# EAGLE design adxrs300_breakout (EAGLE 6.1)
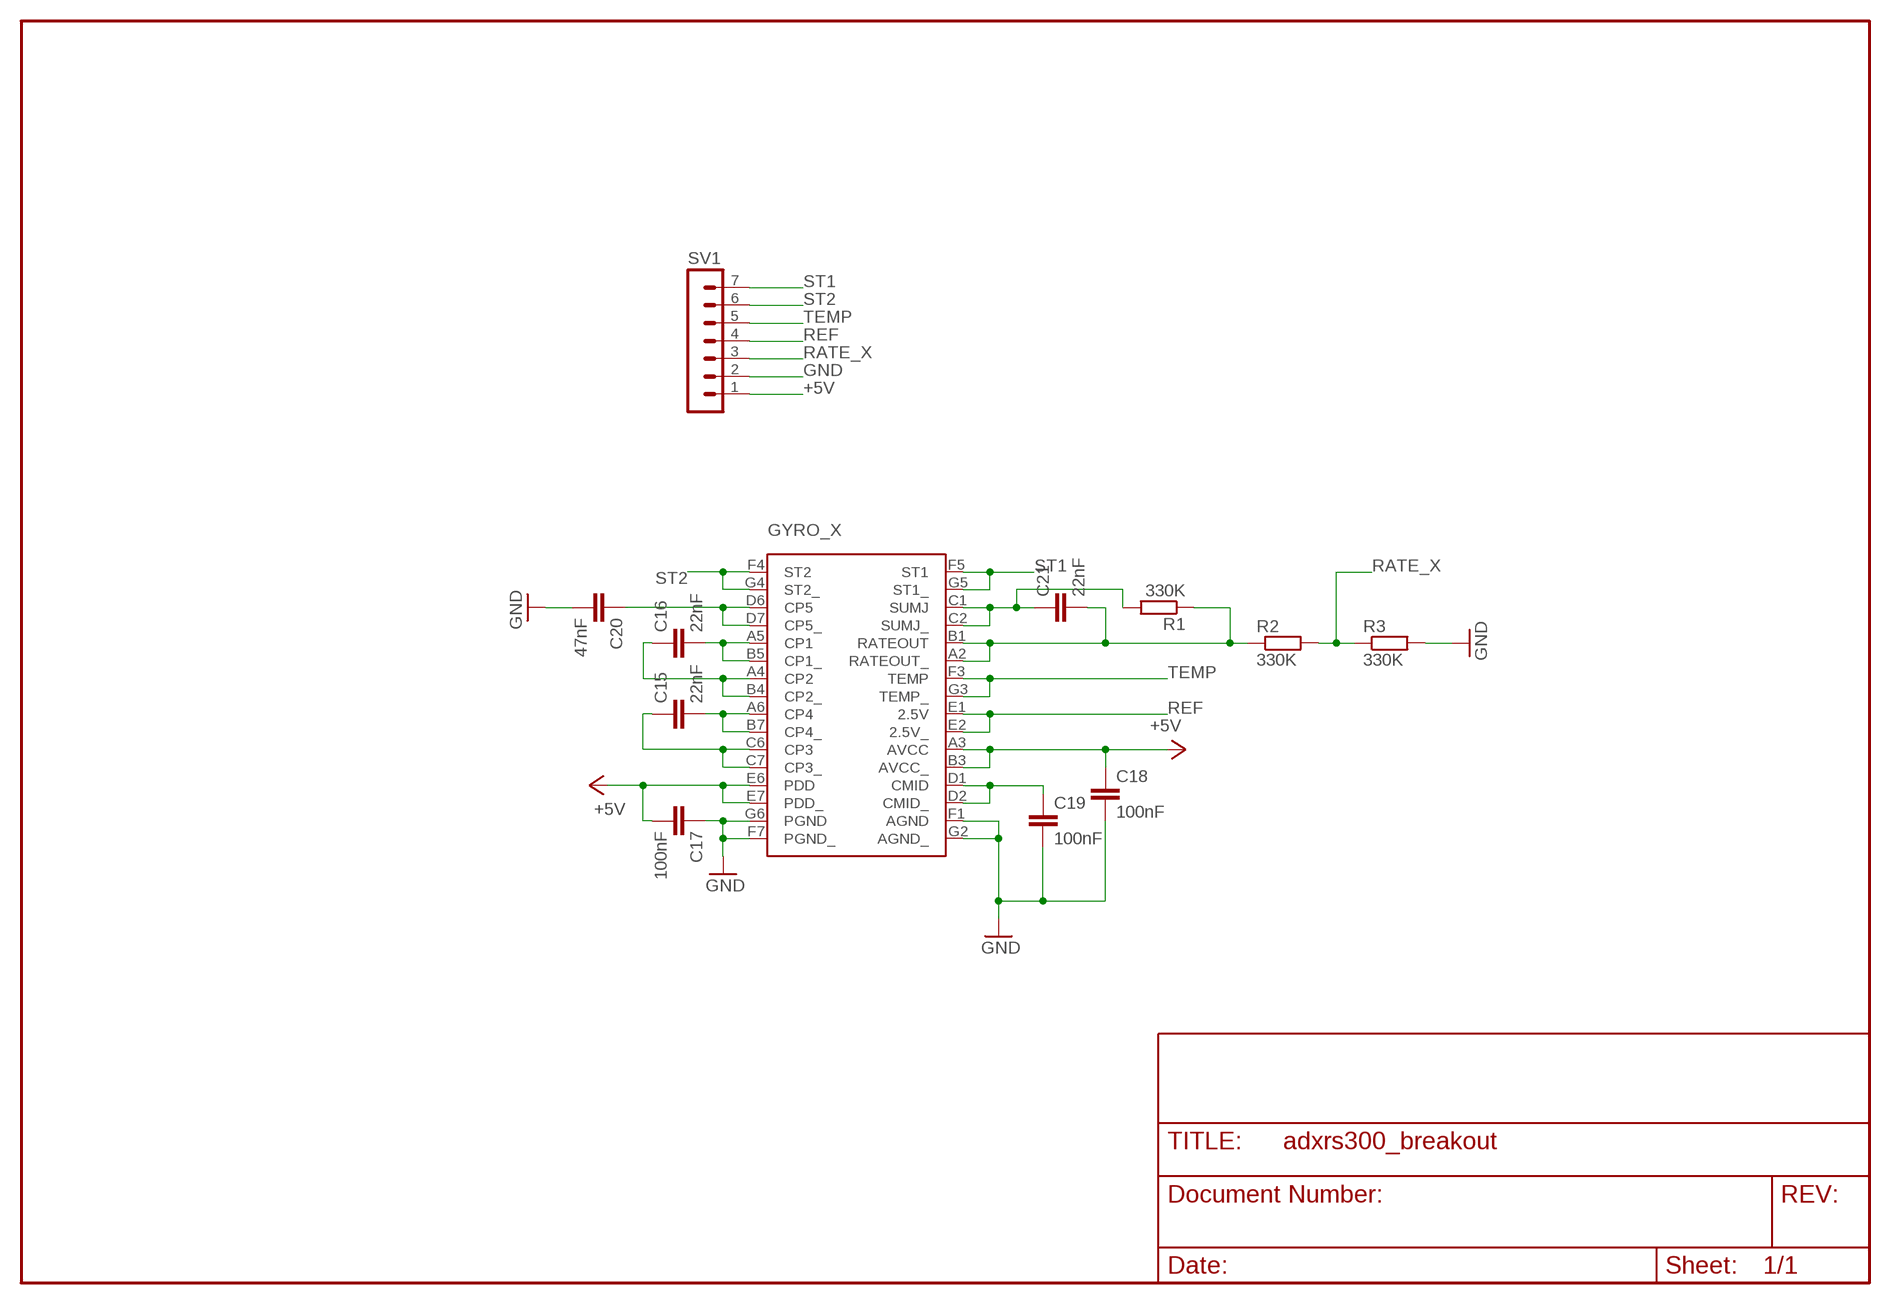
[diagram p0: schematic, sheet 1]

## Parts
C15  22nF  C-EUC0603K  [C0603K]
C16  22nF  C-EUC0603K  [C0603K]
C17  100nF  C-EUC0603K  [C0603K]
C18  100nF  C-EUC0603K  [C0603K]
C19  100nF  C-EUC0603K  [C0603K]
C20  47nF  C-EUC0603K  [C0603K]
C21  22nF  C-EUC0603K  [C0603K]
GYRO_X  ADXR  [BC-32]
R1  330K  R-EU_R0603  [R0603]
R2  330K  R-EU_R0603  [R0603]
R3  330K  R-EU_R0603  [R0603]
SV1  MA07-1  [MA07-1]

## Nets
+5V [power]: C17.2 C18.1 GYRO_X.A3(AVCC) GYRO_X.B3(AVCC_) GYRO_X.E6(PDD) GYRO_X.E7(PDD_) SV1.1
GND [power]: C17.1 C18.2 C19.2 C20.2 GYRO_X.F1(AGND) GYRO_X.F7(PGND_) GYRO_X.G2(AGND_) GYRO_X.G6(PGND) R3.2 SV1.2
N$6: C21.1 GYRO_X.C1(SUMJ) GYRO_X.C2(SUMJ_) R1.2
N$7: C15.1 GYRO_X.C6(CP3) GYRO_X.C7(CP3_)
N$11: C20.1 GYRO_X.D6(CP5) GYRO_X.D7(CP5_)
N$12: C16.2 GYRO_X.A5(CP1) GYRO_X.B5(CP1_)
N$13: C16.1 GYRO_X.A4(CP2) GYRO_X.B4(CP2_)
N$14: C15.2 GYRO_X.A6(CP4) GYRO_X.B7(CP4_)
N$19: C19.1 GYRO_X.D1(CMID) GYRO_X.D2(CMID_)
RATE_5V: C21.2 GYRO_X.A2(RATEOUT_) GYRO_X.B1(RATEOUT) R1.1 R2.1
RATE_X: R2.2 R3.1 SV1.3
REF: GYRO_X.E1(2.5V) GYRO_X.E2(2.5V_) SV1.4
ST1: GYRO_X.F5(ST1) GYRO_X.G5(ST1_) SV1.7
ST2: GYRO_X.F4(ST2) GYRO_X.G4(ST2_) SV1.6
TEMP: GYRO_X.F3(TEMP) GYRO_X.G3(TEMP_) SV1.5

## Library data of the parts
C15-C21 = rcl:C-EU: CAPACITOR, European symbol
GYRO_X = paparazzi:ADXR
R1-R3 = rcl:R-EU_: RESISTOR, European symbol
SV1 = con-lstb:MA07-1: PIN HEADER

## Net classes
0 default: width 0.305 mm, drill 0.305 mm, clearance 0.305 mm
1 power: width 0.305 mm, drill 0.305 mm, clearance 0.305 mm

## Board
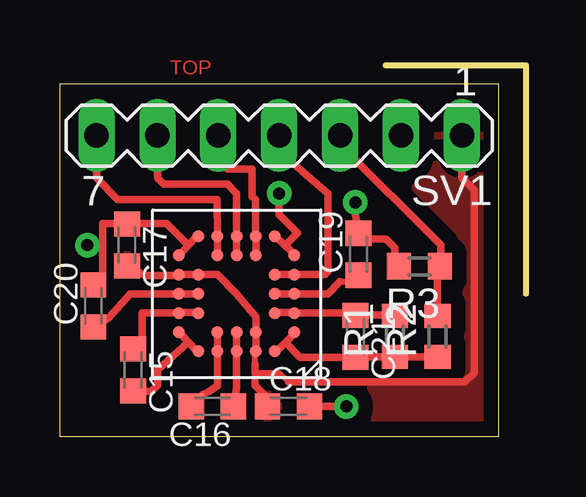
[diagram p1: board, top side]
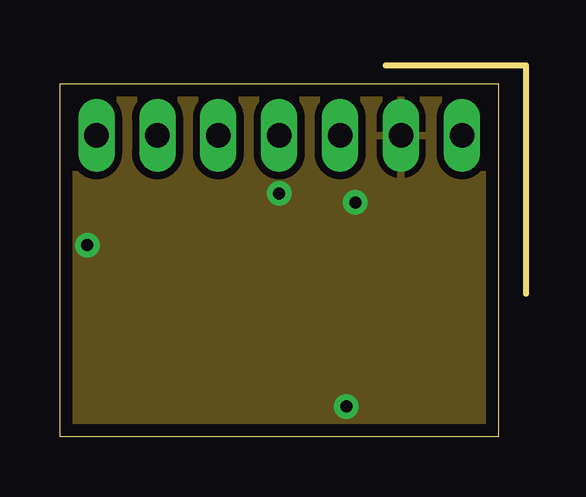
[diagram p2: board, inner layer Route2]
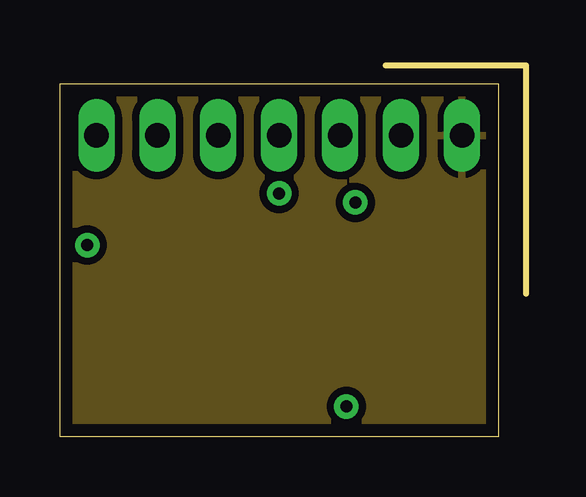
[diagram p3: board, inner layer Route15]
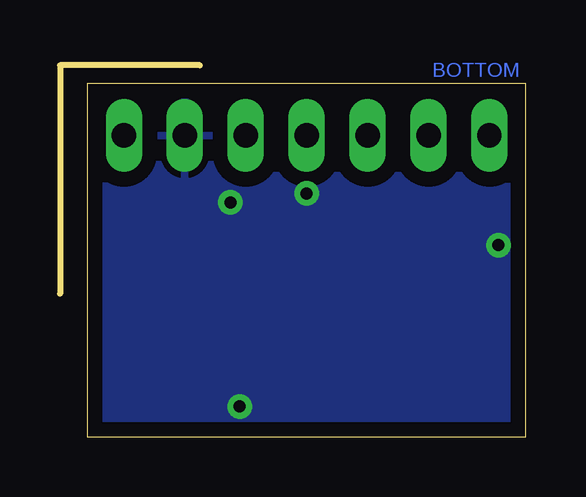
[diagram p4: board, bottom side, seen from below]

Size 19.43 x 15.49 mm. Coordinates in mm from the lower left corner, seen from the top.
Outline: 13.59,15.49 19.43,15.49 19.43,5.97
Outline: 0,0 0,14.73 18.29,14.73 18.29,0 0,0
Copper layers (1*2+15*16): Top 0.035mm / dielectric 0.2mm / Route2 0.035mm / dielectric 1.5mm / Route15 0.035mm / dielectric 0.2mm / Bottom 0.035mm
Design rules: minimum track width 0.15mm, minimum drill 0.35mm, track to track 0.15mm, track to pad 0.15mm, pad to pad 0.15mm, via to via 0.15mm, smd to smd 0.15mm, copper to edge 20mil, drill to drill 8mil, minimum pad ring 10mil, minimum via ring 7mil, stop-mask expansion 4mil, vias tented up to drill 0mil, thermal gap 10mil
tRestrict: area 3.9,2.5 to 10.8,9.4
vRestrict: area 3.8,2.4 to 10.9,9.4

### Footprints (pad centres in the part's own frame; a part is rotated, then mirrored left to right if it is on the bottom)
C0603K = smd 1.05 x 1.08: 1 -0.875,0; 2 0.875,0
BC-32 = smd 0.5 x 0.5: A2 -1.6,2.4; A3 -0.8,2.4; A4 0,2.4; A5 0.8,2.4; A6 1.6,2.4; B1 -2.4,1.6; B3 -0.8,1.6; B4 0,1.6; B5 0.8,1.6; B7 2.4,1.6; C1 -2.4,0.8; C2 -1.6,0.8; C6 1.6,0.8; C7 2.4,0.8; D1 -2.4,0; D2 -1.6,0; D6 1.6,0; D7 2.4,0; E1 -2.4,-0.8; E2 -1.6,-0.8; E6 1.6,-0.8; E7 2.4,-0.8; F1 -2.4,-1.6; F3 -0.8,-1.6; F4 0,-1.6; F5 0.8,-1.6; F7 2.4,-1.6; G2 -1.6,-2.4; G3 -0.8,-2.4; G4 0,-2.4; G5 0.8,-2.4; G6 1.6,-2.4
R0603 = smd 1 x 1.1: 1 -0.85,0; 2 0.85,0
MA07-1 = drill 1.016 long: 1 -7.62,0; 2 -5.08,0; 3 -2.54,0; 4 0,0; 5 2.54,0; 6 5.08,0; 7 7.62,0

### Placement (x,y rotation side)
C15  3.05,2.79 270 top
C16  6.35,1.27 180 top
C17  2.79,8 270 top
C18  9.53,1.27 0 top
C19  12.45,7.62 90 top
C20  1.4,5.46 90 top
C21  12.32,4.19 270 top
GYRO_X  7.37,5.97 180 top
R1  13.97,4.19 90 top
R2  15.75,4.19 90 top
R3  14.99,7.11 180 top
SV1  9.14,12.57 180 top

### Tracks (layer width: path | path; a pad name or v marks a point on that pad's centre or on a via)
+5V
  Top 0.254: 8.64,1.65 8.65,1.64 C18.1 8.64,1.27 8.51,1.4 8.51,1.78 | 8.13,3.05 8.13,3.56 | 8.13,2.31 8.13,2.67 | 9.53,2.29 9.14,2.67 8.13,2.67 | 8.13,2.67
  Top 0.305: 4.95,6.73 4.95,6.86 GYRO_X.E7 | 4.95,6.73 4.88,6.77 | C17.2 3.56,6.73 4.95,6.73 | GYRO_X.E7 4.95,6.73 | 8.13,3.56 GYRO_X.A3 8.18,3.81 8.18,4.14 GYRO_X.B3 8.17,4.36 GYRO_X.B3 8.17,5 7.37,5.97 6.57,6.77 GYRO_X.E6 GYRO_X.E7 | SV1.1 16.76,10.79 17.27,10.29 17.27,2.67 16.89,2.29 9.53,2.29 | 8.13,2.67 8.13,3.05 | 8.13,2.31 8.13,2.15 8.51,1.78
  pour Route15: 18.67,14.73 -0.13,14.73 -0.13,0.64 18.67,0.64
  pour Top (isolate 0.61): -0.25,14.48 -0.25,0.25 18.29,0.25 18.29,14.61 0.13,14.61
GND  (via drill 0.5 pad 1.02)
  Top 0.305: 1.78,8 1.78,8.89 2.29,8.89 C17.1 3.3,8.89 4.45,8.89 5.33,8 5.35,7.99 | 1.78,8 1.78,6.86 C20.2 | R3.2 13.97,7.11 13.97,7.87 13.59,8.26 12.32,8.26 C19.2 12.32,9.27 v12.32,9.78 | C18.2 v11.94,1.27 | 1.78,8 v1.14,8 | v9.14,10.16 9.14,9.27 9.91,8.51 9.4,8 9.38,7.99 | GYRO_X.F1 9.78,7.62 9.38,7.99 | 9.38,7.99 GYRO_X.G2 | GYRO_X.G6 5.71,8.38 5.35,7.99 | 5.35,7.99 GYRO_X.F7
  pour Route2: 18.29,14.73 -0.38,14.86 -0.38,0.64 18.29,0.51
  pour Bottom (isolate 0.61): 0.13,0.25 0.13,14.73 18.41,14.73 18.41,0.25
N$6
  Top 0.254: C21.1 12.23,5.17 | 13.97,5.08 R1.2
  Top 0.305: C21.1 12.45,5.08 13.97,5.08 | GYRO_X.C2 9.2,5.18 9.53,5.18 GYRO_X.C1 12.23,5.17
N$7
  Top 0.305: C15.1 3.43,4.19 3.43,5.17 GYRO_X.C7 5.21,5.18 5.54,5.18 GYRO_X.C6
N$11
  Top 0.305: C20.1 1.4,4.57 2.03,4.95 2.92,5.97 GYRO_X.D7 GYRO_X.D6
N$12
  Top 0.305: C16.2 5.71,1.52 5.97,1.78 6.22,1.91 6.57,2.13 6.57,2.74 GYRO_X.A5 6.58,3.81 6.58,4.14 GYRO_X.B5
N$13
  Top 0.305: C16.1 7.37,2.03 GYRO_X.A4 GYRO_X.B4
N$14
  Top 0.305: C15.2 3.17,1.91 3.81,1.91 4.06,2.16 4.06,2.79 5.33,3.94 5.35,3.95 | GYRO_X.A6 5.71,3.56 5.35,3.95 | 5.35,3.95 GYRO_X.B7
N$19
  Top 0.254: C19.1 12.45,6.6 12.32,6.48 11.68,6.48
  Top 0.305: GYRO_X.D2 GYRO_X.D1 11.18,5.97 11.68,6.48
RATE_5V
  Top 0.254: R1.1 13.97,3.3 14.01,3.34 | C21.2 12.32,3.3 | 9.78,4.32 9.77,4.33 GYRO_X.B1 | GYRO_X.A2 9.03,3.57
  Top 0.305: 14.01,3.34 R2.1 | R1.1 12.36,3.34 12.32,3.3 | 9.03,3.57 9.4,3.94 | 9.4,3.94 9.78,4.32 | C21.2 10.02,3.32 9.4,3.94
RATE_X
  Top 0.305: R2.2 15.75,7.11 R3.1 15.84,7.2 15.88,7.24 15.88,8 11.68,12.19 SV1.3
REF
  Top 0.305: SV1.4 9.14,11.94 10.29,10.92 11.18,10.16 11.18,7.11 11.19,6.89 11.05,6.77 GYRO_X.E1 9.53,6.78 9.2,6.78 GYRO_X.E2
ST1
  Top 0.305: SV1.7 1.52,10.79 2.41,9.91 6.56,9.91 GYRO_X.G5 6.58,8.13 6.58,7.8 GYRO_X.F5
ST2
  Top 0.305: SV1.6 4.06,10.79 4.32,10.54 6.99,10.54 7.37,10.16 GYRO_X.G4 GYRO_X.F4
TEMP
  Top 0.305: SV1.5 6.6,11.56 6.99,11.18 8,11.18 8,10.03 8.16,9.91 8.16,8.51 GYRO_X.G3 8.18,8.13 8.18,7.8 GYRO_X.F3

### Text on the board
Top: TOP
Bottom: BOTTOM